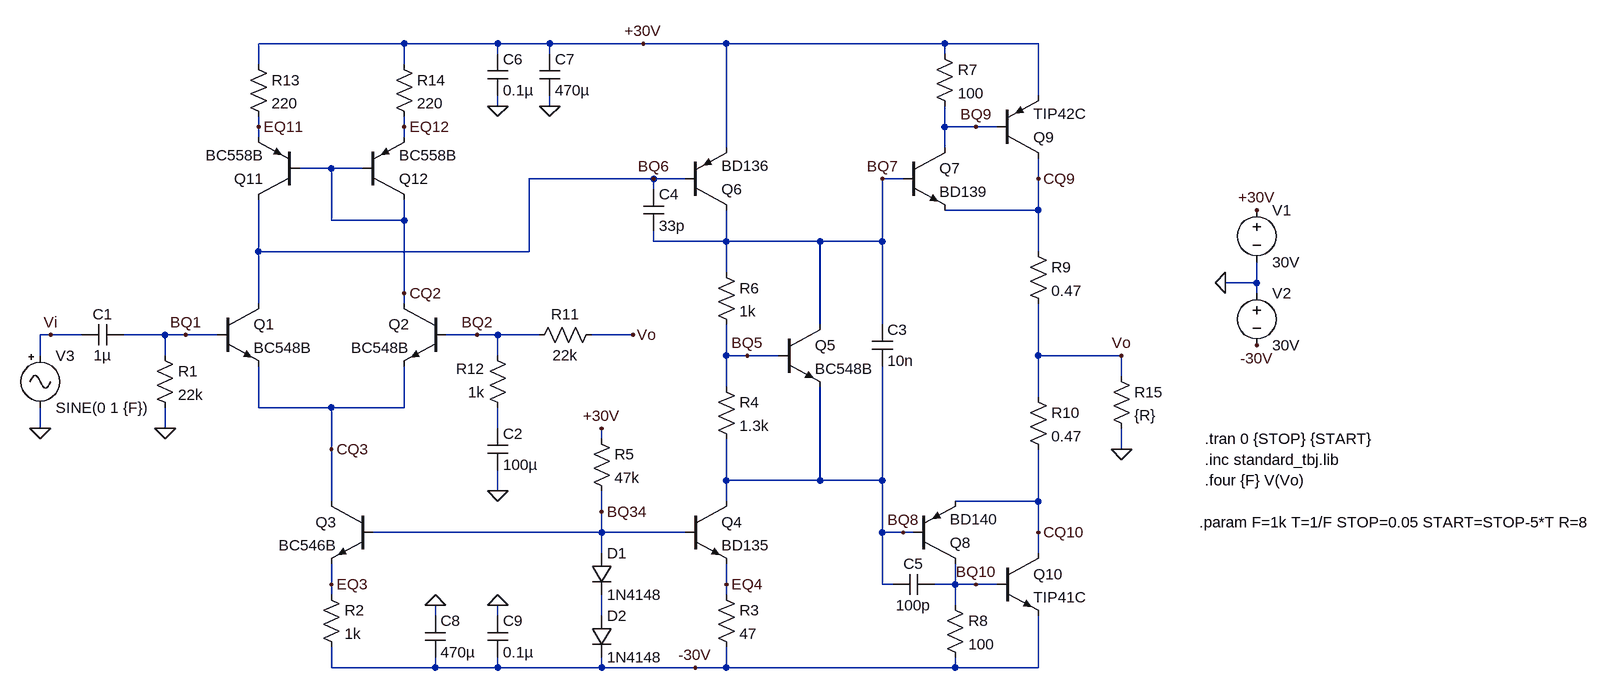
[diagram p0: schematic Clase_B.asc]
Clase_B.asc, the LTspice schematic file:
Version 4
SHEET 1 2480 1108
WIRE 96 -224 -128 -224
WIRE 240 -224 96 -224
WIRE 320 -224 240 -224
WIRE 464 -224 320 -224
WIRE 592 -224 464 -224
WIRE 928 -224 592 -224
WIRE 1072 -224 928 -224
WIRE 240 -208 240 -224
WIRE 320 -208 320 -224
WIRE 928 -208 928 -224
WIRE -128 -192 -128 -224
WIRE 96 -192 96 -224
WIRE 1072 -144 1072 -224
WIRE 240 -128 240 -144
WIRE 320 -128 320 -144
WIRE -128 -96 -128 -112
WIRE 96 -96 96 -112
WIRE 928 -96 928 -128
WIRE 976 -96 928 -96
WIRE 1008 -96 976 -96
WIRE -128 -80 -128 -96
WIRE 96 -80 96 -96
WIRE 592 -64 592 -224
WIRE 928 -64 928 -96
WIRE -16 -32 -64 -32
WIRE 32 -32 -16 -32
WIRE 480 -16 288 -16
WIRE 528 -16 480 -16
WIRE 864 -16 832 -16
WIRE 1072 -16 1072 -48
WIRE 480 0 480 -16
WIRE 1072 32 1072 -16
WIRE 1072 32 928 32
WIRE -16 48 -16 -32
WIRE 96 48 96 16
WIRE 96 48 -16 48
WIRE 480 80 480 64
WIRE 592 80 592 32
WIRE 592 80 480 80
WIRE 736 80 592 80
WIRE 832 80 832 -16
WIRE 832 80 736 80
WIRE -128 96 -128 16
WIRE 288 96 288 -16
WIRE 288 96 -128 96
WIRE 1072 96 1072 32
WIRE 592 128 592 80
WIRE 1408 144 1408 112
WIRE 1408 144 1360 144
WIRE 96 160 96 48
WIRE 1408 160 1408 144
WIRE -128 176 -128 96
WIRE 96 176 96 160
WIRE 736 208 736 80
WIRE 832 208 832 80
WIRE -448 224 -464 224
WIRE -400 224 -448 224
WIRE -272 224 -336 224
WIRE -240 224 -272 224
WIRE -192 224 -240 224
WIRE 208 224 160 224
WIRE 240 224 208 224
WIRE 304 224 240 224
WIRE 448 224 384 224
WIRE -464 256 -464 224
WIRE -272 256 -272 224
WIRE 240 256 240 224
WIRE 592 256 592 208
WIRE 624 256 592 256
WIRE 672 256 624 256
WIRE 1072 256 1072 176
WIRE 1200 256 1072 256
WIRE 1200 288 1200 256
WIRE 592 304 592 256
WIRE 1072 320 1072 256
WIRE -128 336 -128 272
WIRE -16 336 -128 336
WIRE 96 336 96 272
WIRE 96 336 -16 336
WIRE -464 368 -464 336
WIRE -272 368 -272 336
WIRE 240 368 240 336
WIRE 400 384 400 368
WIRE -16 400 -16 336
WIRE 1200 400 1200 368
WIRE 592 448 592 384
WIRE 736 448 736 304
WIRE 736 448 592 448
WIRE 832 448 832 272
WIRE 832 448 736 448
WIRE 240 464 240 432
WIRE -16 480 -16 400
WIRE 592 480 592 448
WIRE 1072 480 1072 400
WIRE 1072 480 944 480
WIRE 400 496 400 464
WIRE 400 528 400 496
WIRE 400 528 48 528
WIRE 528 528 400 528
WIRE 832 528 832 448
WIRE 864 528 832 528
WIRE 880 528 864 528
WIRE 1072 528 1072 480
WIRE 400 560 400 528
WIRE 1072 560 1072 528
WIRE -16 608 -16 576
WIRE 592 608 592 576
WIRE 832 608 832 528
WIRE 848 608 832 608
WIRE 944 608 944 576
WIRE 944 608 912 608
WIRE 976 608 944 608
WIRE 1008 608 976 608
WIRE -16 624 -16 608
WIRE 592 624 592 608
WIRE 944 640 944 608
WIRE 144 656 144 640
WIRE 240 656 240 640
WIRE 400 656 400 624
WIRE -16 736 -16 704
WIRE 144 736 144 720
WIRE 144 736 -16 736
WIRE 240 736 240 720
WIRE 240 736 144 736
WIRE 400 736 400 720
WIRE 400 736 240 736
WIRE 544 736 400 736
WIRE 592 736 592 704
WIRE 592 736 544 736
WIRE 944 736 944 720
WIRE 944 736 592 736
WIRE 1072 736 1072 656
WIRE 1072 736 944 736
FLAG 1360 144 0
FLAG 1408 32 +30V
FLAG 464 -224 +30V
FLAG 1408 240 -30V
FLAG 544 736 -30V
FLAG 240 464 0
FLAG -464 368 0
FLAG 1200 256 Vo
FLAG -448 224 Vi
FLAG 480 -16 BQ6
FLAG -16 400 CQ3
FLAG -16 608 EQ3
FLAG 400 496 BQ34
FLAG 592 608 EQ4
FLAG 832 -16 BQ7
FLAG 864 528 BQ8
FLAG 976 -96 BQ9
FLAG 976 608 BQ10
FLAG 1072 528 CQ10
FLAG 1072 -16 CQ9
FLAG -272 368 0
FLAG 448 224 Vo
FLAG -128 -96 EQ11
FLAG 96 -96 EQ12
FLAG 96 160 CQ2
FLAG 208 224 BQ2
FLAG -240 224 BQ1
FLAG 624 256 BQ5
FLAG 1200 400 0
FLAG 400 368 +30V
FLAG 320 -128 0
FLAG 144 640 0
FLAG 240 -128 0
FLAG 240 640 0
SYMBOL npn -192 176 R0
SYMATTR InstName Q1
SYMATTR Value BC548B
SYMBOL npn 160 176 M0
SYMATTR InstName Q2
SYMATTR Value BC548B
SYMBOL npn 48 480 M0
SYMATTR InstName Q3
SYMATTR Value BC546B
SYMBOL npn 528 480 R0
SYMATTR InstName Q4
SYMATTR Value BD135
SYMBOL npn 672 208 R0
SYMATTR InstName Q5
SYMATTR Value BC548B
SYMBOL pnp 528 32 M180
SYMATTR InstName Q6
SYMATTR Value BD136
SYMBOL res 576 112 R0
SYMATTR InstName R6
SYMATTR Value 1k
SYMBOL res 576 288 R0
SYMATTR InstName R4
SYMATTR Value 1.3k
SYMBOL diode 384 560 R0
SYMATTR InstName D1
SYMATTR Value 1N4148
SYMBOL diode 384 656 R0
SYMATTR InstName D2
SYMATTR Value 1N4148
SYMBOL res -32 608 R0
SYMATTR InstName R2
SYMATTR Value 1k
SYMBOL res 576 608 R0
SYMATTR InstName R3
SYMATTR Value 47
SYMBOL res 384 368 R0
SYMATTR InstName R5
SYMATTR Value 47k
SYMBOL voltage 1408 16 R0
WINDOW 123 0 0 Left 2
WINDOW 39 0 0 Left 2
SYMATTR InstName V1
SYMATTR Value 30V
SYMBOL voltage 1408 144 R0
SYMATTR InstName V2
SYMATTR Value 30V
SYMBOL res 1056 80 R0
SYMATTR InstName R9
SYMATTR Value 0.47
SYMBOL res 1056 304 R0
SYMATTR InstName R10
SYMATTR Value 0.47
SYMBOL npn 864 -64 R0
SYMATTR InstName Q7
SYMATTR Value BD139
SYMBOL pnp 1008 -48 M180
SYMATTR InstName Q9
SYMATTR Value TIP42C
SYMBOL res 912 -224 R0
SYMATTR InstName R7
SYMATTR Value 100
SYMBOL pnp 880 576 M180
SYMATTR InstName Q8
SYMATTR Value BD140
SYMBOL npn 1008 560 R0
SYMATTR InstName Q10
SYMATTR Value TIP41C
SYMBOL res 928 624 R0
SYMATTR InstName R8
SYMATTR Value 100
SYMBOL res 400 208 R90
WINDOW 0 0 56 VBottom 2
WINDOW 3 32 56 VTop 2
SYMATTR InstName R11
SYMATTR Value 22k
SYMBOL res 256 352 R180
WINDOW 0 36 76 Left 2
WINDOW 3 36 40 Left 2
SYMATTR InstName R12
SYMATTR Value 1k
SYMBOL cap 464 0 R0
SYMATTR InstName C4
SYMATTR Value 33p
SYMBOL cap 224 368 R0
SYMATTR InstName C2
SYMATTR Value 100µ
SYMBOL cap -400 240 R270
WINDOW 0 32 32 VTop 2
WINDOW 3 0 32 VBottom 2
SYMATTR InstName C1
SYMATTR Value 1µ
SYMBOL res -288 240 R0
SYMATTR InstName R1
SYMATTR Value 22k
SYMBOL pnp -64 16 R180
SYMATTR InstName Q11
SYMATTR Value BC558B
SYMBOL pnp 32 16 M180
SYMATTR InstName Q12
SYMATTR Value BC558B
SYMBOL res -144 -208 R0
SYMATTR InstName R13
SYMATTR Value 220
SYMBOL res 80 -208 R0
SYMATTR InstName R14
SYMATTR Value 220
SYMBOL cap 912 592 R90
WINDOW 0 0 32 VBottom 2
WINDOW 3 32 32 VTop 2
SYMATTR InstName C5
SYMATTR Value 100p
SYMBOL res 1184 272 R0
SYMATTR InstName R15
SYMATTR Value {R}
SYMBOL cap 816 208 R0
SYMATTR InstName C3
SYMATTR Value 10n
SYMBOL cap 304 -208 R0
SYMATTR InstName C7
SYMATTR Value 470µ
SYMBOL cap 128 656 R0
SYMATTR InstName C8
SYMATTR Value 470µ
SYMBOL Misc\\signal -464 240 R0
WINDOW 123 0 0 Left 0
WINDOW 39 0 0 Left 0
SYMATTR InstName V3
SYMATTR Value SINE(0 1 {F})
SYMBOL cap 224 -208 R0
SYMATTR InstName C6
SYMATTR Value 0.1µ
SYMBOL cap 224 656 R0
SYMATTR InstName C9
SYMATTR Value 0.1µ
TEXT 1328 416 Left 2 !.inc standard_tbj.lib
TEXT 1328 448 Left 2 !.four {F} V(Vo)
TEXT 1320 512 Left 2 !.param F=1k T=1/F STOP=0.05 START=STOP-5*T R=8
TEXT 1328 384 Left 2 !.tran 0 {STOP} {START}

The netlist it stands for:
* Clase_B.asc
Q1 BQ6 BQ1 CQ3 0 BC548B
Q2 CQ2 BQ2 CQ3 0 BC548B
Q3 CQ3 BQ34 EQ3 0 BC546B
Q4 BQ8 BQ34 EQ4 0 BD135
Q5 BQ7 BQ5 BQ8 0 BC548B
Q6 BQ7 BQ6 +30V 0 BD136
R6 BQ7 BQ5 1k
R4 BQ5 BQ8 1.3k
D1 BQ34 N002 1N4148
D2 N002 -30V 1N4148
R2 EQ3 -30V 1k
R3 EQ4 -30V 47
R5 +30V BQ34 47k
V1 +30V 0 30V
V2 0 -30V 30V
R9 CQ9 Vo 0.47
R10 Vo CQ10 0.47
Q7 BQ9 BQ7 CQ9 0 BD139
Q9 CQ9 BQ9 +30V 0 TIP42C
R7 +30V BQ9 100
Q8 BQ10 BQ8 CQ10 0 BD140
Q10 CQ10 BQ10 -30V 0 TIP41C
R8 BQ10 -30V 100
R11 Vo BQ2 22k
R12 N001 BQ2 1k
C4 BQ6 BQ7 33p
C2 N001 0 100µ
C1 Vi BQ1 1µ
R1 BQ1 0 22k
Q11 BQ6 CQ2 EQ11 0 BC558B
Q12 CQ2 CQ2 EQ12 0 BC558B
R13 +30V EQ11 220
R14 +30V EQ12 220
C5 BQ10 BQ8 100p
R15 Vo 0 {R}
C3 BQ7 BQ8 10n
C7 +30V 0 470µ
C8 0 -30V 470µ
V3 Vi 0 SINE(0 1 {F})
C6 +30V 0 0.1µ
C9 0 -30V 0.1µ
.model D D
.lib standard.dio
.model NPN NPN
.model PNP PNP
.lib standard.bjt
.inc standard_tbj.lib
.four {F} V(Vo)
.param F=1k T=1/F STOP=0.05 START=STOP-5*T R=8
.tran 0 {STOP} {START}
.backanno
.end